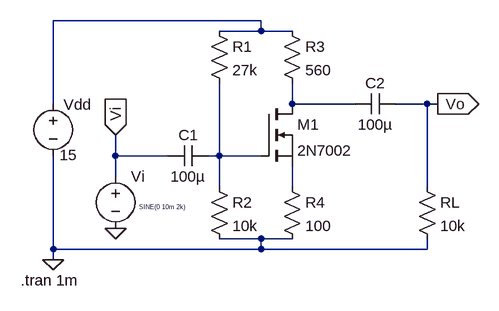
[diagram p0: schematic ProjetoFinal.asc]
ProjetoFinal.asc, the LTspice schematic file:
Version 4
SHEET 1 880 680
WIRE -432 -320 -752 -320
WIRE -432 -304 -432 -320
WIRE -432 -304 -496 -304
WIRE -384 -304 -432 -304
WIRE -752 -192 -752 -320
WIRE -384 -192 -384 -224
WIRE -288 -192 -384 -192
WIRE -176 -192 -224 -192
WIRE -160 -192 -176 -192
WIRE -656 -112 -656 -144
WIRE -576 -112 -656 -112
WIRE -496 -112 -496 -224
WIRE -496 -112 -512 -112
WIRE -432 -112 -496 -112
WIRE -656 -80 -656 -112
WIRE -496 -64 -496 -112
WIRE -384 -64 -384 -96
WIRE -176 -64 -176 -192
WIRE -432 16 -496 16
WIRE -384 16 -432 16
WIRE -752 32 -752 -112
WIRE -432 32 -432 16
WIRE -432 32 -752 32
WIRE -176 32 -176 16
WIRE -176 32 -432 32
WIRE -752 48 -752 32
FLAG -752 48 0
FLAG -656 0 0
FLAG -160 -192 Vo
IOPIN -160 -192 Out
FLAG -656 -144 Vi
IOPIN -656 -144 In
SYMBOL res -512 -320 R0
SYMATTR InstName R1
SYMATTR Value 27k
SYMBOL res -512 -80 R0
SYMATTR InstName R2
SYMATTR Value 10k
SYMBOL res -400 -320 R0
SYMATTR InstName R3
SYMATTR Value 560
SYMBOL res -400 -80 R0
SYMATTR InstName R4
SYMATTR Value 100
SYMBOL nmos -432 -192 R0
SYMATTR InstName M1
SYMATTR Value 2N7002
SYMBOL res -192 -80 R0
SYMATTR InstName RL
SYMATTR Value 10k
SYMBOL cap -512 -128 R90
WINDOW 0 0 32 VBottom 2
WINDOW 3 32 32 VTop 2
SYMATTR InstName C1
SYMATTR Value 100µ
SYMBOL cap -224 -208 R90
WINDOW 0 0 32 VBottom 2
WINDOW 3 32 32 VTop 2
SYMATTR InstName C2
SYMATTR Value 100µ
SYMBOL voltage -752 -208 R0
WINDOW 123 0 0 Left 0
WINDOW 39 0 0 Left 0
WINDOW 0 16 17 Left 2
WINDOW 3 10 95 Left 2
SYMATTR InstName Vdd
SYMATTR Value 15
SYMBOL voltage -656 -96 R0
WINDOW 3 36 63 Left 0
WINDOW 123 0 0 Left 0
WINDOW 39 0 0 Left 0
SYMATTR Value SINE(0 10m 2k)
SYMATTR InstName Vi
TEXT -802 80 Left 2 !.tran 1m

The netlist it stands for:
* ProjetoFinal.asc
R1 N001 N003 27k
R2 N003 0 10k
R3 N001 N002 560
R4 N004 0 100
M1 N002 N003 N004 N004 2N7002
RL Vo 0 10k
C1 N003 Vi 100µ
C2 Vo N002 100µ
Vdd N001 0 15
Vi Vi 0 SINE(0 10m 2k)
.model NMOS NMOS
.model PMOS PMOS
.lib standard.mos
.tran 1m
.backanno
.end